# EAGLE design Thermocouple_datalogger_RevB (EAGLE 7.5.0)
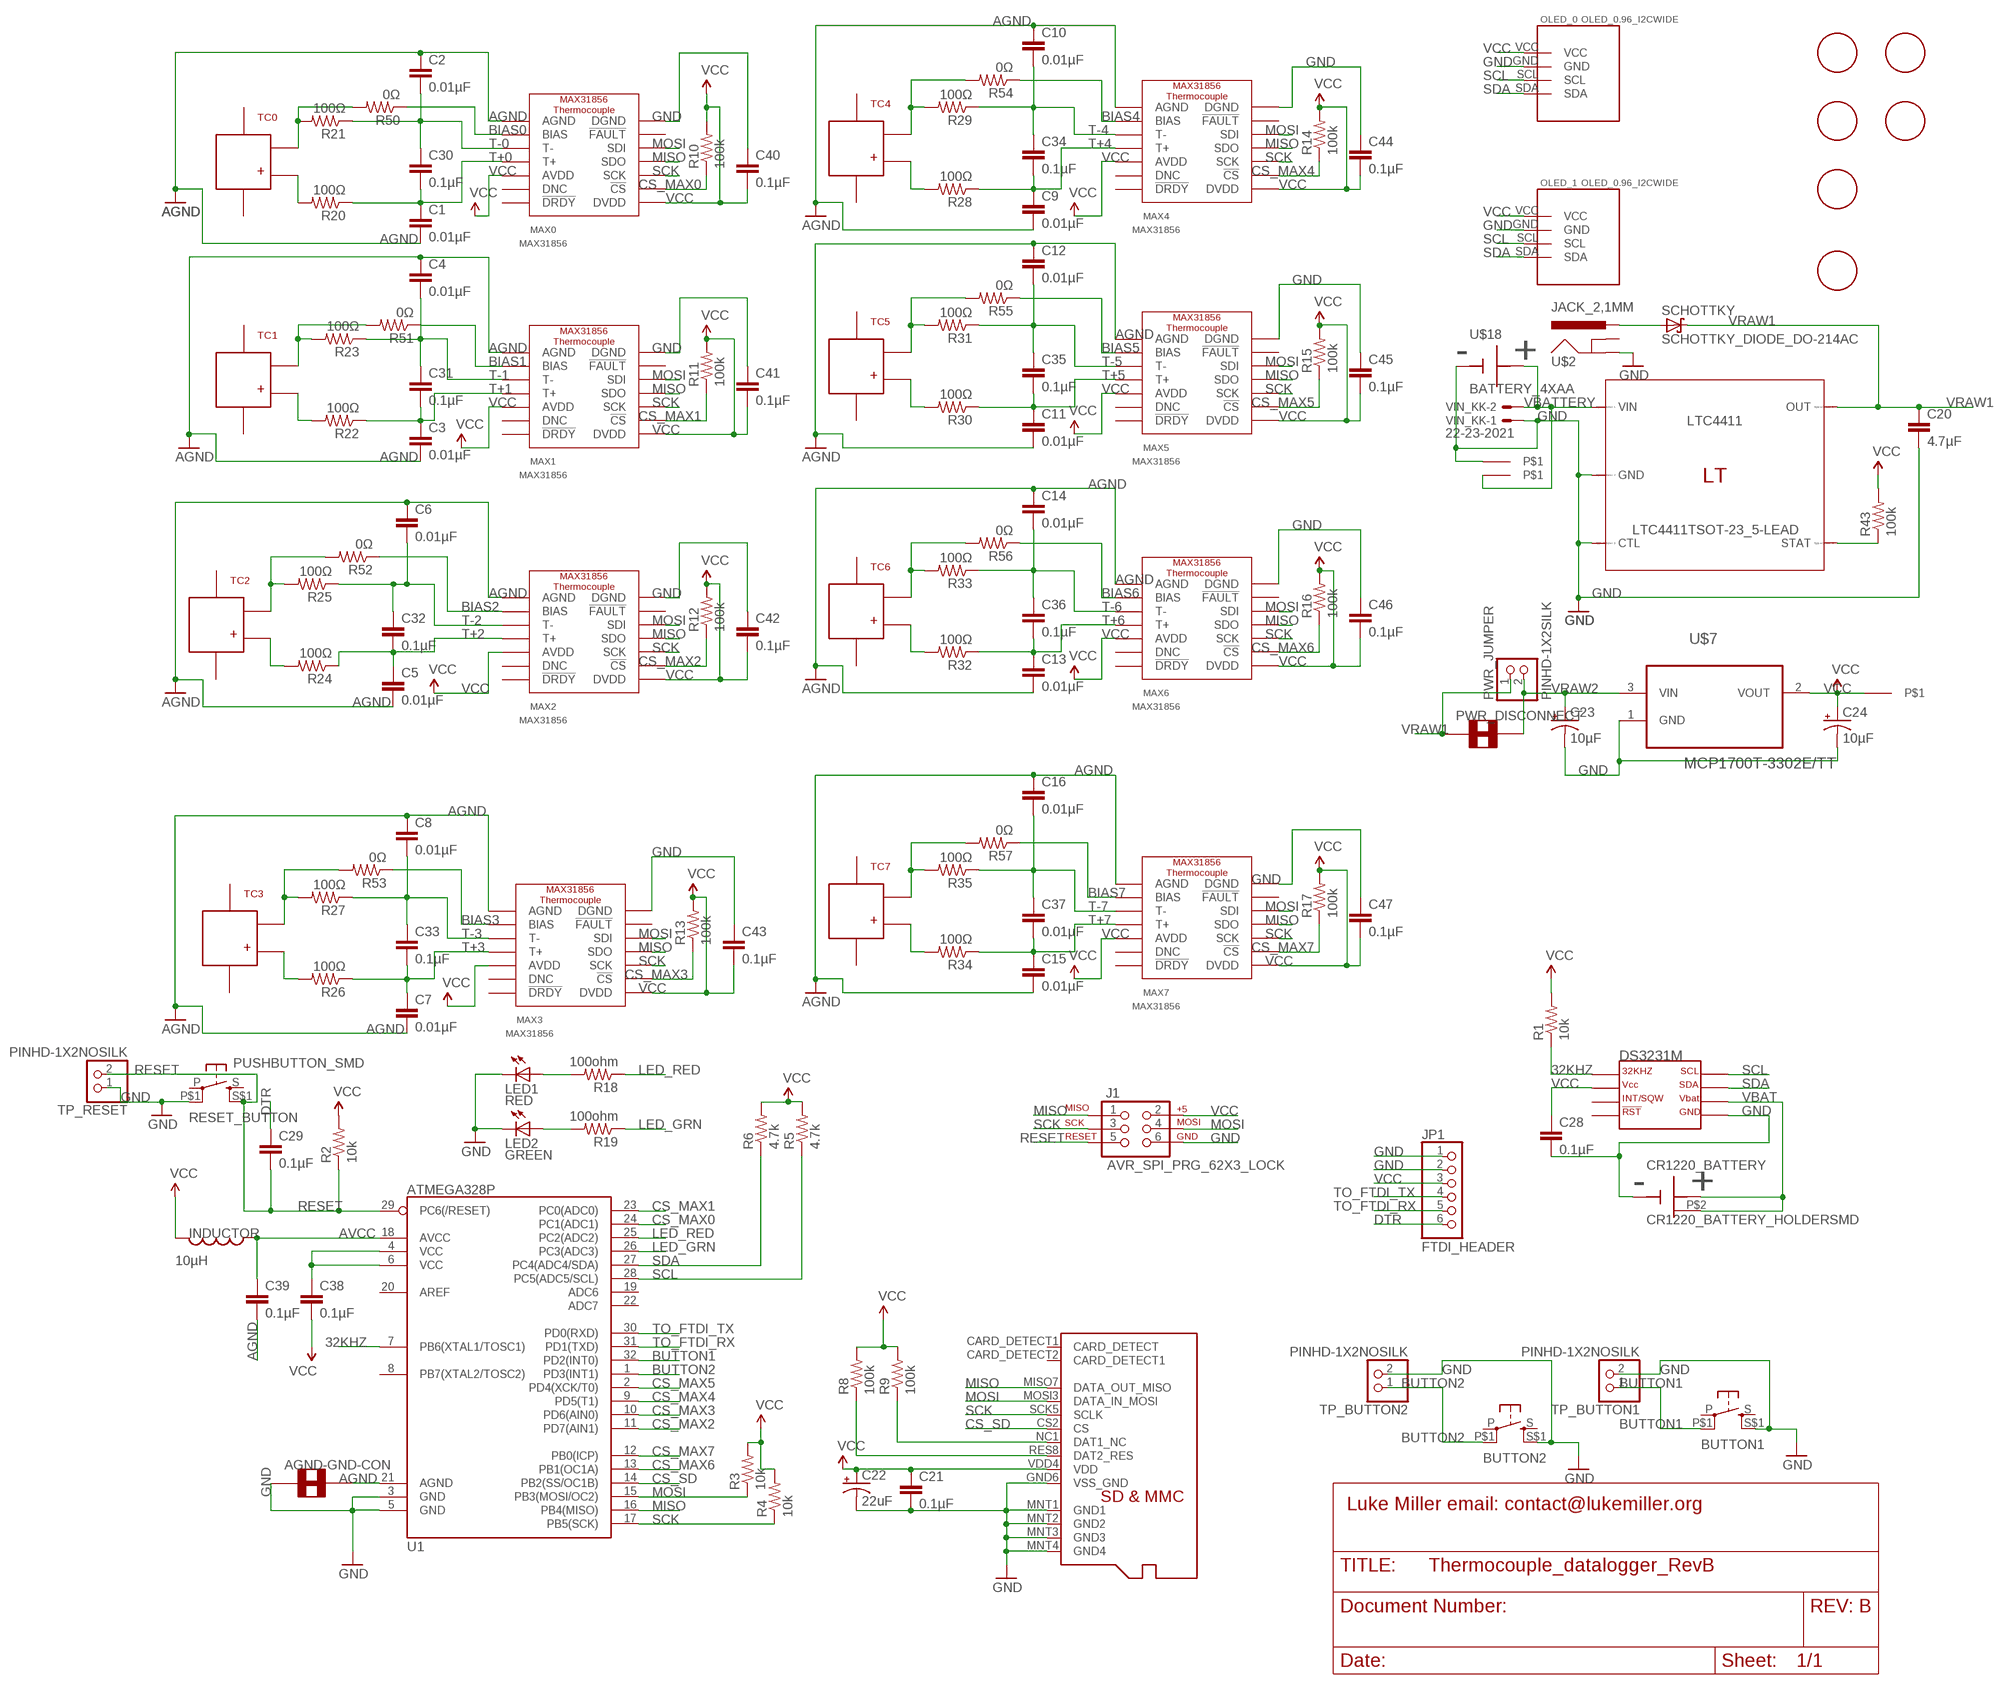
[diagram p0: schematic, sheet 1]

## Parts
AGND-GND-CON  SOLDER_JUMPER_TRACESTANDARD  [SJ_2S-TRACE]
BUTTON1  PUSHBUTTON_DPST_SMDSTANDARD  [PUSHBUTTON_DPST_SMD]
BUTTON2  PUSHBUTTON_DPST_SMDSTANDARD  [PUSHBUTTON_DPST_SMD]
C1  0.01µF  CAP0805  [0805]
C2  0.01µF  CAP0805  [0805]
C3  0.01µF  CAP0805  [0805]
C4  0.01µF  CAP0805  [0805]
C5  0.01µF  CAP0805  [0805]
C6  0.01µF  CAP0805  [0805]
C7  0.01µF  CAP0805  [0805]
C8  0.01µF  CAP0805  [0805]
C9  0.01µF  CAP0805  [0805]
C10  0.01µF  CAP0805  [0805]
C11  0.01µF  CAP0805  [0805]
C12  0.01µF  CAP0805  [0805]
C13  0.01µF  CAP0805  [0805]
C14  0.01µF  CAP0805  [0805]
C15  0.01µF  CAP0805  [0805]
C16  0.01µF  CAP0805  [0805]
C20  4.7µF  CAP0805  [0805]
C21  0.1µF  CAP0805  [0805]
C22  22uF  CPOL-US0805  [C0805_POL]
C23  10µF  CPOL-USB  [PANASONIC_B]
C24  10µF  CPOL-USB  [PANASONIC_B]
C28  0.1µF  CAP0805  [0805]
C29  0.1µF  CAP0805  [0805]
C30  0.1µF  CAP0805  [0805]
C31  0.1µF  CAP0805  [0805]
C32  0.1µF  CAP0805  [0805]
C33  0.1µF  CAP0805  [0805]
C34  0.1µF  CAP0805  [0805]
C35  0.1µF  CAP0805  [0805]
C36  0.1µF  CAP0805  [0805]
C37  0.01µF  CAP0805  [0805]
C38  0.1µF  CAP0805  [0805]
C39  0.1µF  CAP0805  [0805]
C40  0.1µF  CAP0805  [0805]
C41  0.1µF  CAP0805  [0805]
C42  0.1µF  CAP0805  [0805]
C43  0.1µF  CAP0805  [0805]
C44  0.1µF  CAP0805  [0805]
C45  0.1µF  CAP0805  [0805]
C46  0.1µF  CAP0805  [0805]
C47  0.1µF  CAP0805  [0805]
CR1220_BATTERY  CR1220_BATTERY_HOLDERSMD  [CR1220_BATTERY_HOLDER_SMD]
DS3231M  DS3231MSOIC-8  [DS3231M_SOIC8]
INDUCTOR  10µH  INDUCTOR0805_TY  [I_0805]
J1  AVR_SPI_PRG_62X3_LOCK  [2X3_LOCK]
JP1  FTDI_HEADER  PINHD-1X6RA  [1X06-RIGHT_ANGLE]
LED1  RED  LED0805  [CHIPLED_0805]
LED2  GREEN  LED0805  [CHIPLED_0805]
LTC4411  LTC4411TSOT-23_5-LEAD  [TSOT-23_5-LEAD]
MAX0  MAX31856  [MAX31856_TSSOP14]
MAX1  MAX31856  [MAX31856_TSSOP14]
MAX2  MAX31856  [MAX31856_TSSOP14]
MAX3  MAX31856  [MAX31856_TSSOP14]
MAX4  MAX31856  [MAX31856_TSSOP14]
MAX5  MAX31856  [MAX31856_TSSOP14]
MAX6  MAX31856  [MAX31856_TSSOP14]
MAX7  MAX31856  [MAX31856_TSSOP14]
OLED_0  OLED_0.96_I2CWIDE  [OLED_0.96_I2C_VCC_PIN1_WIDE]
OLED_1  OLED_0.96_I2CWIDE  [OLED_0.96_I2C_VCC_PIN1_WIDE]
PWR_DISCONNECT  SOLDER_JUMPER_TRACESTANDARD  [SJ_2S-TRACE]
PWR_JUMPER  PINHD-1X2SILK  [1X02]
R1  10k  RESISTOR_SMDR0805  [R0805]
R2  10k  RESISTOR_SMDR0805  [R0805]
R3  10k  RESISTOR_SMDR0805  [R0805]
R4  10k  RESISTOR_SMDR0805  [R0805]
R5  4.7k  RESISTOR_SMDR0805  [R0805]
R6  4.7k  RESISTOR_SMDR0805  [R0805]
R8  100k  RESISTOR_SMDR0805  [R0805]
R9  100k  RESISTOR_SMDR0805  [R0805]
R10  100k  RESISTOR_SMDR0805  [R0805]
R11  100k  RESISTOR_SMDR0805  [R0805]
R12  100k  RESISTOR_SMDR0805  [R0805]
R13  100k  RESISTOR_SMDR0805  [R0805]
R14  100k  RESISTOR_SMDR0805  [R0805]
R15  100k  RESISTOR_SMDR0805  [R0805]
R16  100k  RESISTOR_SMDR0805  [R0805]
R17  100k  RESISTOR_SMDR0805  [R0805]
R18  100ohm  RESISTOR_SMDR0805  [R0805]
R19  100ohm  RESISTOR_SMDR0805  [R0805]
R20  100Ω  RESISTOR_SMDR0805  [R0805]
R21  100Ω  RESISTOR_SMDR0805  [R0805]
R22  100Ω  RESISTOR_SMDR0805  [R0805]
R23  100Ω  RESISTOR_SMDR0805  [R0805]
R24  100Ω  RESISTOR_SMDR0805  [R0805]
R25  100Ω  RESISTOR_SMDR0805  [R0805]
R26  100Ω  RESISTOR_SMDR0805  [R0805]
R27  100Ω  RESISTOR_SMDR0805  [R0805]
R28  100Ω  RESISTOR_SMDR0805  [R0805]
R29  100Ω  RESISTOR_SMDR0805  [R0805]
R30  100Ω  RESISTOR_SMDR0805  [R0805]
R31  100Ω  RESISTOR_SMDR0805  [R0805]
R32  100Ω  RESISTOR_SMDR0805  [R0805]
R33  100Ω  RESISTOR_SMDR0805  [R0805]
R34  100Ω  RESISTOR_SMDR0805  [R0805]
R35  100Ω  RESISTOR_SMDR0805  [R0805]
R43  100k  RESISTOR_SMDR0805  [R0805]
R50  0Ω  RESISTOR_SMDR0805  [R0805]
R51  0Ω  RESISTOR_SMDR0805  [R0805]
R52  0Ω  RESISTOR_SMDR0805  [R0805]
R53  0Ω  RESISTOR_SMDR0805  [R0805]
R54  0Ω  RESISTOR_SMDR0805  [R0805]
R55  0Ω  RESISTOR_SMDR0805  [R0805]
R56  0Ω  RESISTOR_SMDR0805  [R0805]
R57  0Ω  RESISTOR_SMDR0805  [R0805]
RESET_BUTTON  PUSHBUTTON_SMD  PUSHBUTTON_DPST_SMDSTANDARD  [PUSHBUTTON_DPST_SMD]
SCHOTTKY  SCHOTTKY_DIODE_DO-214AC  [DO214AC]
TC0  PCC-SMP-THERMOCOUPLEVERTICAL  [PCC-SMP-V]
TC1  PCC-SMP-THERMOCOUPLEVERTICAL  [PCC-SMP-V]
TC2  PCC-SMP-THERMOCOUPLEVERTICAL  [PCC-SMP-V]
TC3  PCC-SMP-THERMOCOUPLEVERTICAL  [PCC-SMP-V]
TC4  PCC-SMP-THERMOCOUPLEVERTICAL  [PCC-SMP-V]
TC5  PCC-SMP-THERMOCOUPLEVERTICAL  [PCC-SMP-V]
TC6  PCC-SMP-THERMOCOUPLEVERTICAL  [PCC-SMP-V]
TC7  PCC-SMP-THERMOCOUPLEVERTICAL  [PCC-SMP-V]
TP_BUTTON1  PINHD-1X2NOSILK  [1X02_NOSILK]
TP_BUTTON2  PINHD-1X2NOSILK  [1X02_NOSILK]
TP_GND  PINHD-1X1STANDARD  [1X01]
TP_RESET  PINHD-1X2NOSILK  [1X02_NOSILK]
TP_VBAT  PINHD-1X1STANDARD  [1X01]
U1  ATMEGA328P  ATMEGA328_SMT  [TQFP32-08]
U$2  JACK_2,1MM  POWER_JACK_2,1MM  [POWER_JACK_DC_2,1MM]
U$5  MICROSD_MOLEX_REVERSECURRENT  [MICROSD_SOCKET_MOLEX_REVERSEMOUNT]
U$6  HOLE-LAYOUT4-40-SOCKET-HEAD  [4-40-SCREW-HOLE]
U$7  MCP1700T-3302E/TT  [SOT95P237X112-3N]
U$15  HOLE-LAYOUT4-40-SOCKET-HEAD  [4-40-SCREW-HOLE]
U$16  HOLE-LAYOUT4-40-SOCKET-HEAD  [4-40-SCREW-HOLE]
U$18  BATTERY_4XAA  [BATTERY_4XAA_PTH]
U$23  HOLE-LAYOUT4-40-SOCKET-HEAD  [4-40-SCREW-HOLE]
U$24  HOLE-LAYOUT4-40-SOCKET-HEAD  [4-40-SCREW-HOLE]
U$25  HOLE-LAYOUT4-40-SOCKET-HEAD  [4-40-SCREW-HOLE]
VCC  PINHD-1X1STANDARD  [1X01]
VIN_KK  22-23-2021  [22-23-2021]

## Nets
32KHZ: DS3231M.1(P$1_32KHZ) R1.1 U1.7(PB6(XTAL1/TOSC1))
AGND: AGND-GND-CON.2 C1.2 C2.1 C3.2 C4.1 C5.2 C6.1 C7.2 C8.1 C9.2 C10.1 C11.2 C12.1 C13.2 C14.1 C15.2 C16.1 C39.2 MAX0.AGND MAX1.AGND MAX2.AGND MAX3.AGND MAX4.AGND MAX5.AGND MAX6.AGND MAX7.AGND U1.21(AGND)
AVCC: C39.1 INDUCTOR.P$1 U1.18(AVCC)
BIAS0: MAX0.BIAS R50.1
BIAS1: MAX1.BIAS R51.1
BIAS2: MAX2.BIAS R52.1
BIAS3: MAX3.BIAS R53.1
BIAS4: MAX4.BIAS R54.1
BIAS5: MAX5.BIAS R55.1
BIAS6: MAX6.BIAS R56.1
BIAS7: MAX7.BIAS R57.1
BUTTON1: BUTTON1.P$1(P1) TP_BUTTON1.1 U1.32(PD2(INT0))
BUTTON2: BUTTON2.P$1(P1) TP_BUTTON2.1 U1.1(PD3(INT1))
CS_MAX0: MAX0.!CS R10.1 U1.24(PC1(ADC1))
CS_MAX1: MAX1.!CS R11.1 U1.23(PC0(ADC0))
CS_MAX2: MAX2.!CS R12.1 U1.11(PD7(AIN1))
CS_MAX3: MAX3.!CS R13.1 U1.10(PD6(AIN0))
CS_MAX4: MAX4.!CS R14.1 U1.9(PD5(T1))
CS_MAX5: MAX5.!CS R15.1 U1.2(PD4(XCK/T0))
CS_MAX6: MAX6.!CS R16.1 U1.13(PB1(OC1A))
CS_MAX7: MAX7.!CS R17.1 U1.12(PB0(ICP))
CS_SD: U1.14(PB2(SS/OC1B)) U$5.CS2(CS)
DTR: C29.1 JP1.6
GND: AGND-GND-CON.1 BUTTON1.S$1(S1) BUTTON2.S$1(S1) C20.2 C21.2 C22.P$2_C(-) C23.- C24.- C28.2 C40.1 C41.1 C42.1 C43.1 C44.1 C45.1 C46.1 C47.1 CR1220_BATTERY.GND DS3231M.5(P$5_GND) J1.6 JP1.1 JP1.2 LED1.C LED2.C LTC4411.2(GND) LTC4411.3(CTL) MAX0.DGND MAX1.DGND MAX2.DGND MAX3.DGND MAX4.DGND MAX5.DGND MAX6.DGND MAX7.DGND OLED_0.GND OLED_1.GND RESET_BUTTON.P$1(P1) TP_BUTTON1.2 TP_BUTTON2.2 TP_GND.1 TP_RESET.1 U1.3(GND) U1.5(GND) U$2.P$2(GND) U$5.GND6(VSS_GND) U$5.MNT1(GND1) U$5.MNT2(GND2) U$5.MNT3(GND3) U$5.MNT4(GND4) U$7.1(GND) U$18.GND VIN_KK.1
LED_GRN: R19.1 U1.26(PC3(ADC3))
LED_RED: R18.1 U1.25(PC2(ADC2))
MISO: J1.1 MAX0.SDO MAX1.SDO MAX2.SDO MAX3.SDO MAX4.SDO MAX5.SDO MAX6.SDO MAX7.SDO U1.16(PB4(MISO)) U$5.MISO7(DATA_OUT_MISO)
MOSI: J1.4 MAX0.SDI MAX1.SDI MAX2.SDI MAX3.SDI MAX4.SDI MAX5.SDI MAX6.SDI MAX7.SDI R3.1 U1.15(PB3(MOSI/OC2)) U$5.MOSI3(DATA_IN_MOSI)
N$1: LTC4411.4(STAT) R43.1
N$2: SCHOTTKY.A U$2.P$1(PWR)
N$5: LED1.A R18.2
N$7: R8.1 U$5.RES8(DAT2_RES)
N$8: R9.1 U$5.NC1(DAT1_NC)
N$9: C38.1 U1.4(VCC) U1.6(VCC)
N$10: LED2.A R19.2
N$13: R22.2 TC1.P$2
N$14: R23.2 R51.2 TC1.P$1
N$17: R24.2 TC2.P$2
N$18: R25.2 R52.2 TC2.P$1
N$21: R26.2 TC3.P$2
N$22: R27.2 R53.2 TC3.P$1
N$25: R28.2 TC4.P$2
N$26: R29.2 R54.2 TC4.P$1
N$29: R30.2 TC5.P$2
N$30: R31.2 R55.2 TC5.P$1
N$33: R32.2 TC6.P$2
N$34: R33.2 R56.2 TC6.P$1
N$37: R34.2 TC7.P$2
N$38: R35.2 R57.2 TC7.P$1
RESET: C29.2 J1.5 R2.1 RESET_BUTTON.S$1(S1) TP_RESET.2 U1.29(PC6(/RESET))
SCK: J1.3 MAX0.SCK MAX1.SCK MAX2.SCK MAX3.SCK MAX4.SCK MAX5.SCK MAX6.SCK MAX7.SCK R4.1 U1.17(PB5(SCK)) U$5.SCK5(SCLK)
SCL: DS3231M.8(P$8_SCL) OLED_0.SCL OLED_1.SCL R5.1 U1.28(PC5(ADC5/SCL))
SDA: DS3231M.7(P$7_SDA) OLED_0.SDA OLED_1.SDA R6.1 U1.27(PC4(ADC4/SDA))
T+0: C1.1 C30.2 MAX0.T+ R20.1
T+0_TERM: R20.2 TC0.P$2
T+1: C3.1 C31.2 MAX1.T+ R22.1
T+2: C5.1 C32.2 MAX2.T+ R24.1
T+3: C7.1 C33.2 MAX3.T+ R26.1
T+4: C9.1 C34.2 MAX4.T+ R28.1
T+5: C11.1 C35.2 MAX5.T+ R30.1
T+6: C13.1 C36.2 MAX6.T+ R32.1
T+7: C15.1 C37.2 MAX7.T+ R34.1
T-0: C2.2 C30.1 MAX0.T- R21.1
T-0_TERM: R21.2 R50.2 TC0.P$1
T-1: C4.2 C31.1 MAX1.T- R23.1
T-2: C6.2 C32.1 MAX2.T- R25.1
T-3: C8.2 C33.1 MAX3.T- R27.1
T-4: C10.2 C34.1 MAX4.T- R29.1
T-5: C12.2 C35.1 MAX5.T- R31.1
T-6: C14.2 C36.1 MAX6.T- R33.1
T-7: C16.2 C37.1 MAX7.T- R35.1
TO_FTDI_RX: JP1.5 U1.31(PD1(TXD))
TO_FTDI_TX: JP1.4 U1.30(PD0(RXD))
VBAT: CR1220_BATTERY.P$1(VBAT) CR1220_BATTERY.P$2 DS3231M.6(P$6_VBAT)
VBATTERY: LTC4411.1(VIN) TP_VBAT.1 U$18.VBAT VIN_KK.2
VCC: C21.1 C22.P$1_A(+) C24.+ C28.1 C38.2 C40.2 C41.2 C42.2 C43.2 C44.2 C45.2 C46.2 C47.2 DS3231M.2(P$2_VCC) INDUCTOR.P$2 J1.2 JP1.3 MAX0.AVDD MAX0.DVDD MAX1.AVDD MAX1.DVDD MAX2.AVDD MAX2.DVDD MAX3.AVDD MAX3.DVDD MAX4.AVDD MAX4.DVDD MAX5.AVDD MAX5.DVDD MAX6.AVDD MAX6.DVDD MAX7.AVDD MAX7.DVDD OLED_0.VCC OLED_1.VCC R1.2 R2.2 R3.2 R4.2 R5.2 R6.2 R8.2 R9.2 R10.2 R11.2 R12.2 R13.2 R14.2 R15.2 R16.2 R17.2 R43.2 U$5.VDD4(VDD) U$7.2(VOUT) VCC.1
VRAW1: C20.1 LTC4411.5(OUT) PWR_DISCONNECT.1 PWR_JUMPER.1 SCHOTTKY.C
VRAW2: C23.+ PWR_DISCONNECT.2 PWR_JUMPER.2 U$7.3(VIN)
Unconnected: BUTTON1.P BUTTON1.S BUTTON2.P BUTTON2.S DS3231M.3(P$3_INT) DS3231M.4(P$4_RST) MAX0.6(DNC) MAX0.!DRDY MAX0.!FAULT MAX1.6(DNC) MAX1.!DRDY MAX1.!FAULT MAX2.6(DNC) MAX2.!DRDY MAX2.!FAULT MAX3.6(DNC) MAX3.!DRDY MAX3.!FAULT MAX4.6(DNC) MAX4.!DRDY MAX4.!FAULT MAX5.6(DNC) MAX5.!DRDY MAX5.!FAULT MAX6.6(DNC) MAX6.!DRDY MAX6.!FAULT MAX7.6(DNC) MAX7.!DRDY MAX7.!FAULT RESET_BUTTON.P RESET_BUTTON.S TC0.P$3 TC0.P$4 TC1.P$3 TC1.P$4 TC2.P$3 TC2.P$4 TC3.P$3 TC3.P$4 TC4.P$3 TC4.P$4 TC5.P$3 TC5.P$4 TC6.P$3 TC6.P$4 TC7.P$3 TC7.P$4 U1.8(PB7(XTAL2/TOSC2)) U1.19(ADC6) U1.20(AREF) U1.22(ADC7) U$2.P$3(GNDBREAK) U$5.CARD_DETECT1(CARD_DETECT) U$5.CARD_DETECT2(CARD_DETECT1)

## Library data of the parts
AGND-GND-CON PWR_DISCONNECT = miller:SOLDER_JUMPER_TRACE: Solder jumper with trace Treat this like a zero ohm resistor. The trace can be cut with a knife.
BUTTON1 BUTTON2 RESET_BUTTON = miller:PUSHBUTTON_DPST_SMD: PUSHBUTTON DPST SMD Omron B3S-1000 Digikey PN SW836CT-ND This is your standard "hobbyist" style momentary pushbutton in a surface mount package.
C1-C16 C20 C21 C28-C47 = miller:CAP: Capacitor Standard surface mount ceramic capacitor and 0.1" leaded capacitor.
C22-C24 = miller:CPOL-US: POLARIZED CAPACITOR, American symbol
CR1220_BATTERY = miller:CR1220_BATTERY_HOLDER: CR1220 Battery Holder Keystone Part # 3001 Digikey 3001K-ND
DS3231M = miller:DS3231M: DS3231M real time clock Battery backup, 2.3V to 5.5V supply voltage 1Hz and 32.768kHz outputs NOTE: This is a slightly lower cost version of the regular DS3231S, with fewer clock frequency output options and slightly lower long-term time accuracy. It uses the same I2C communications protocol as the DS3231S, and is available in a small SOIC-8 package or Wide SOIC-16 (0.300") package. Maxim PN DS3231MZ+ SOIC-8 package Maxim PN DS3231M+ SOIC-16 Wide package
INDUCTOR = miller:INDUCTOR: Inductor Example: Taiyo Yuden PN LBR2012T100K
J1 = miller:AVR_SPI_PRG_6: AVR ISP 6 Pin This is the reduced ISP connector for AVR programming. Common on Arduino. This footprint will take up less PCB space and can be used with a 10-pin to 6-pin adapter such as SKU: BOB-08508 **Special note about "TEST_POINT" package. The stop mask is on the top side, so if you want your programming test points to be on the bottom of your board, make sure to place this package on the bottom side of the board. This also ensure that the orientation to program from the bottom side will be correct.
JP1 = miller:PINHD-1X6: PIN HEADER
LED1 LED2 = miller:LED: LEDs Standard schematic elements and footprints for 5mm, 3mm, 1206, and 0603 sized LEDs. 5mm - Spark Fun Electronics SKU : COM-00529 (and others)
LTC4411 = miller:LTC4411: 2.6A Low Loss Ideal diode in ThinSOT; SPICEMODEL: LTC4411.sub; VALUE2: LTC4411
MAX0 MAX1-MAX7 = miller:MAX31856: MAX31856 Thermocouple convertor Maxim Integrated Digikey PN MAX31856MUD+-ND <https://www.digikey.com/product-detail/en/maxim-integrated/MAX31856MUD-/MAX31856MUD--ND/5050138>
OLED_0 OLED_1 = miller:OLED_0.96_I2C: CHECK VCC & GND PIN VARIANT OLED 128x64 0.96" I2C module Generic 4-pin I2C OLED module from ebay/amazon etc. SSD1306 driver
PWR_JUMPER TP_BUTTON1 TP_BUTTON2 TP_RESET = miller:PINHD-1X2: 1x2 pin header 0.1" spacing (2.54mm)
R1-R6 R8-R35 R43 R50-R57 = miller:RESISTOR_SMD: RESISTOR, American symbol
SCHOTTKY = miller:SCHOTTKY_DIODE: Schottky diode Example Vishay SS12-E3/61T, Digikey PN SS12-E3/61TGICT-ND
TC0 TC1-TC7 = miller:PCC-SMP-THERMOCOUPLE: PCC-SMP Miniature thermocouple mount connector. Omega Engineering PCC-SMP or PCC-SMP-V (vertical mount)
TP_GND TP_VBAT VCC = miller:PINHD-1X1: Just a single pin header, useful for making test point or stand-alone header hole for normal 0.1" pitch through-hole header pins The SMALL footprint is 0.035" diameter, barely large enough for standard 0.1" pitch header pins. The SMALL_0.7 footprint is 1.056mm diameter, drill hole is 0.7mm, too small for 0.1" pitch header pins
U1 = miller:ATMEGA328_SMT: 32-Pin Atmega328
U$2 = miller:POWER_JACK_2,1MM: DC Power Jack, 2.1mm center pin. Digikey PN CP-202AH-ND
U$5 = miller:MICROSD_MOLEX_REVERSE: Molex micro SD connector, push-push spring loaded, "reverse" mount Pins accessible at rear of case. Active: Molex PN 5027740891 Digikey PN WM24066CT-ND Obsolete: Molex PN 49225-201
U$6 U$15 U$16 U$23-U$25 = miller:HOLE-LAYOUT: Drill hole
U$7 = Microchip_By_element14_Batch_1:MCP1700T-3302E/TT: Low Quiescent Current LDO; MPN: MCP1700T-3302E/TT; OC_FARNELL: 1296592; OC_NEWARK: 88H9817; PACKAGE: SOT23-3; SUPPLIER: Microchip
U$18 = miller:BATTERY_4XAA: Battery holder 4xAA Plastic, through-hole mount, 4xAA. Keystone PN 2477
VIN_KK = miller:22-23-2021: Molex KK series .100" (2.54mm) Center Header - 2 Pin; MF: MOLEX; MPN: 22-23-2021; OC_FARNELL: 1462926; OC_NEWARK: 25C3832

## Board
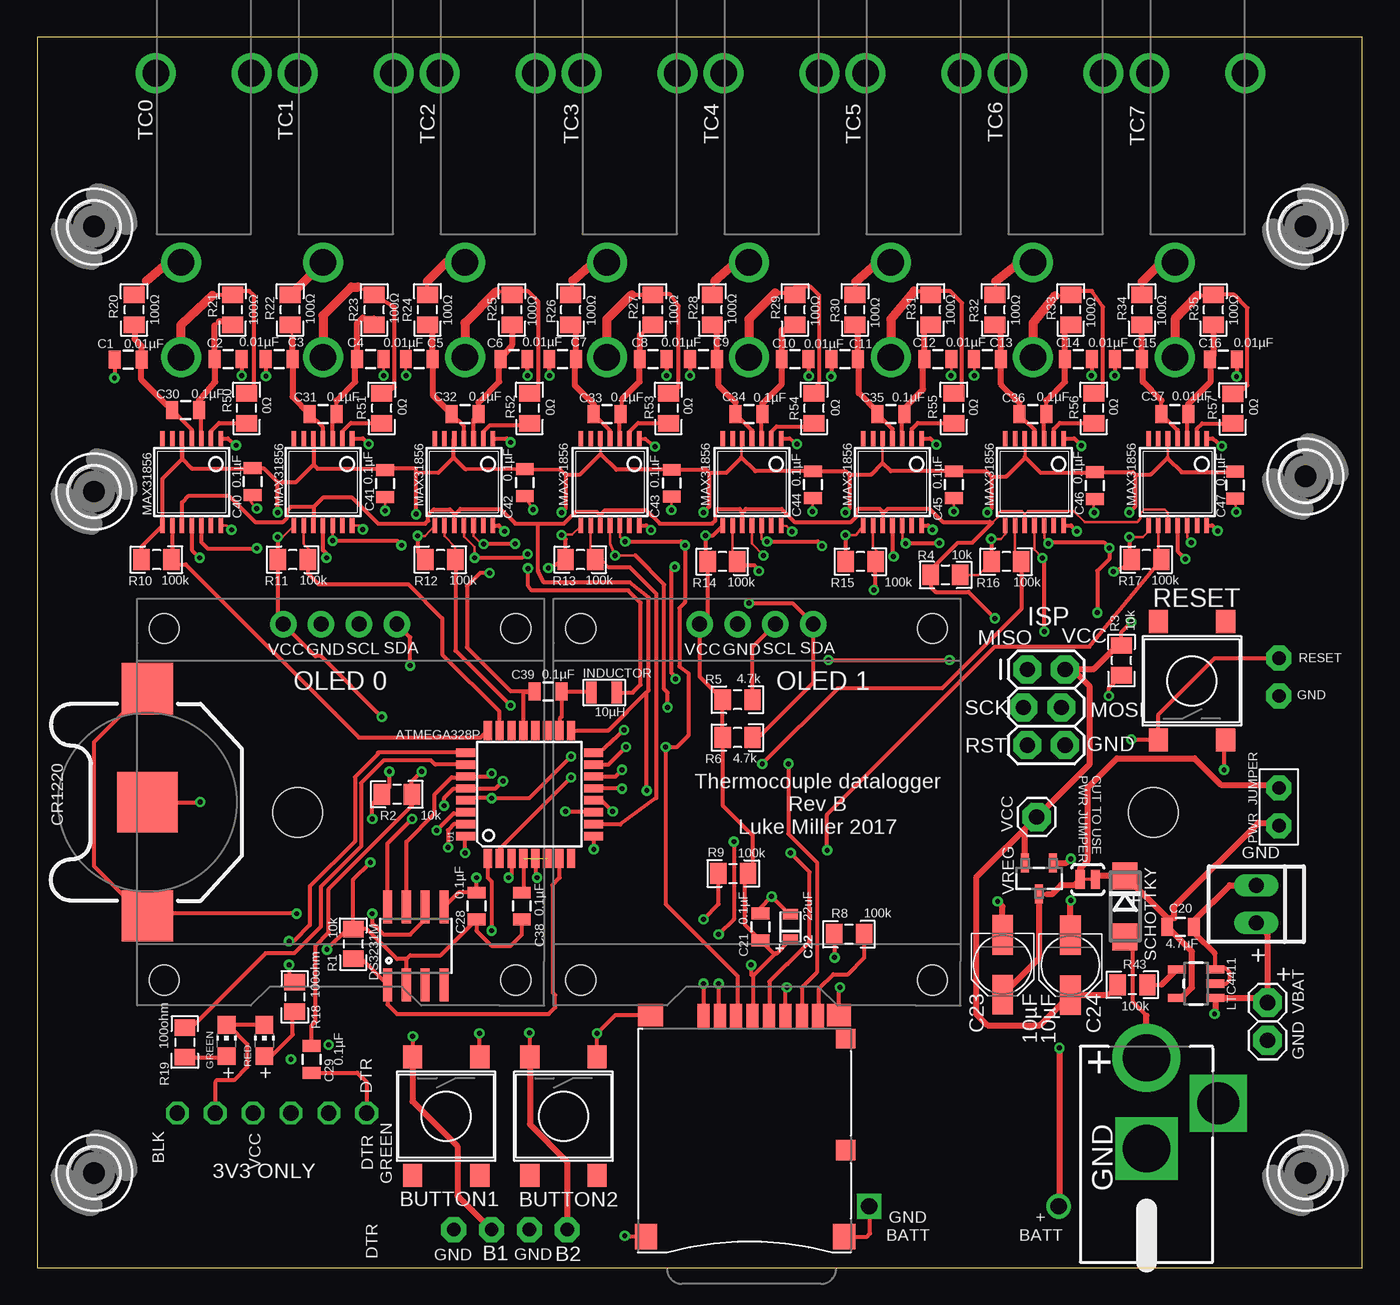
[diagram p1: board, top side]
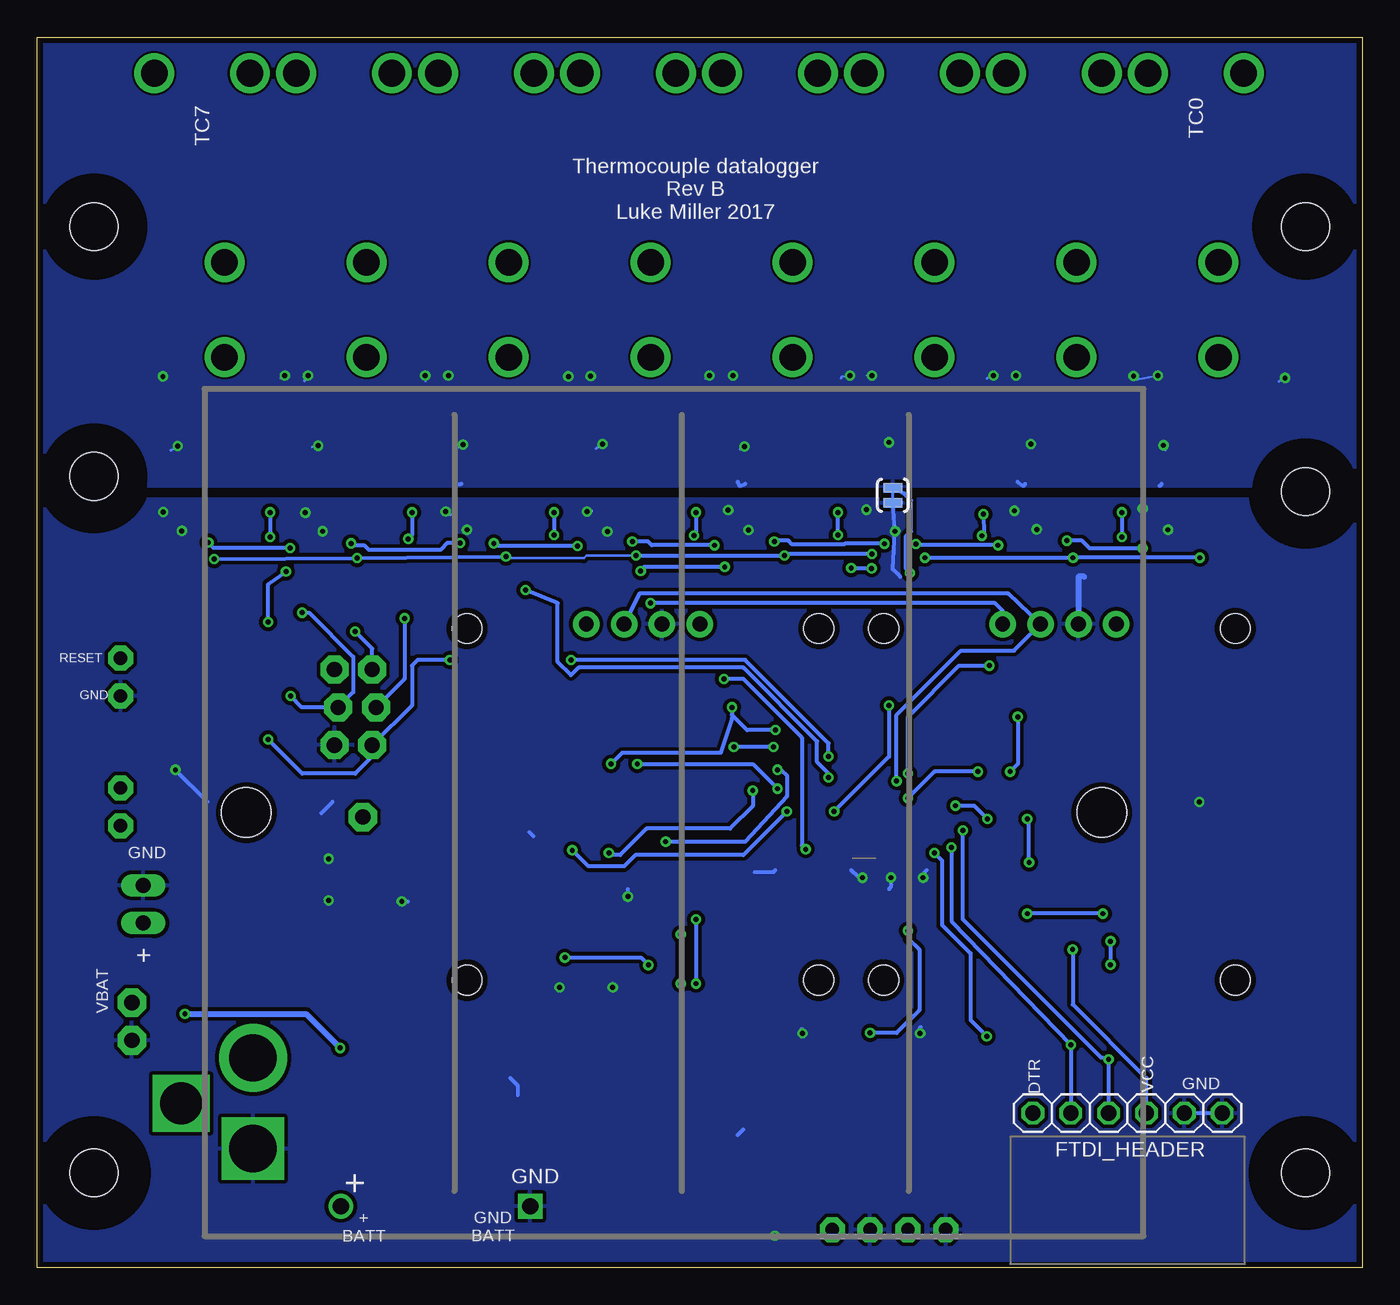
[diagram p2: board, bottom side, seen from below]

Size 88.9 x 82.55 mm. Coordinates in mm from the lower left corner, seen from the top.
Outline: 0,0 88.9,0 88.9,82.55 0,82.55 0,0
Copper layers (1*16): Top 0.0356mm / dielectric 1.5011mm / Bottom 0.0356mm
Design rules "LaenPCBOrder *": minimum track width 6mil, minimum drill 13mil, track to track 6mil, track to pad 6mil, pad to pad 6mil, via to via 6mil, smd to smd 6mil, copper to edge 15mil, drill to drill 6mil, minimum pad ring 7mil, minimum via ring 7mil, stop-mask expansion 3mil, vias tented up to drill 30mil, thermal gap 10mil

### Footprints (pad centres in the part's own frame; a part is rotated, then mirrored left to right if it is on the bottom)
SJ_2S-TRACE = smd 0.635 x 1.27: 1 -0.508,0; 2 0.508,0
PUSHBUTTON_DPST_SMD = smd 1.55 x 1.3: P 3.975,-2.25; P$1 -3.975,-2.25; S 3.975,2.25; S$1 -3.975,2.25
0805 = smd 0.8 x 1.2: 1 -0.9,0; 2 0.9,0
C0805_POL = smd 0.7 x 1: P$1_A -0.85,0; P$2_C 0.85,0
PANASONIC_B = smd 2.667 x 1.4: + 2.006,0; - -2.006,0
CR1220_BATTERY_HOLDER_SMD = smd 4.064 x 4.064: GND 0,0 | smd 3.429 x 3.429: P$1 -7.62,0; P$2 7.62,0
DS3231M_SOIC8 = smd 0.61 x 2.21: 1 -1.905,-2.616; 2 -0.635,-2.616; 3 0.635,-2.616; 4 1.905,-2.616; 5 1.905,2.616; 6 0.635,2.616; 7 -0.635,2.616; 8 -1.905,2.616
I_0805 = smd 0.7 x 1.45: P$1 -0.85,0; P$2 0.85,0
2X3_LOCK = drill 1.016 pad 1.88 octagon: 1 0,0; 2 0,2.54; 3 2.54,-0.254; 4 2.54,2.286; 5 5.08,0; 6 5.08,2.54
1X06-RIGHT_ANGLE = drill 1.016 octagon: 1 0,0; 2 2.54,0; 3 5.08,0; 4 7.62,0; 5 10.16,0; 6 12.7,0
CHIPLED_0805 = smd 1.2 x 1.2: A 0,-1.05; C 0,1.05
TSOT-23_5-LEAD = smd 0.55 x 1.2: 1 -0.95,-1.3; 2 0,-1.3; 3 0.95,-1.3; 4 0.95,1.3; 5 -0.95,1.3
MAX31856_TSSOP14 = smd 0.991 x 0.305: 6 -2.918,-1.3; !CS 2.918,-1.3; !DRDY -2.918,-1.95; !FAULT 2.918,1.3; AGND -2.918,1.95; AVDD -2.918,-0.65; BIAS -2.918,1.3; DGND 2.918,1.95; DVDD 2.918,-1.95; SCK 2.918,-0.65; SDI 2.918,0.65; SDO 2.918,0; T+ -2.918,0; T- -2.918,0.65
OLED_0.96_I2C_VCC_PIN1_WIDE = drill 1 pad 1.778: GND -1.274,-0.003; SCL 1.266,-0.003; SDA 3.806,-0.003; VCC -3.814,-0.003 | hole 2: -11.798,-23.899; 11.798,-23.899; 11.798,-0.303; -11.798,-0.303
1X02 = drill 0.9 pad 1.676 octagon: 1 -1.27,0; 2 1.27,0
R0805 = smd 1.1 x 1.4: 1 -1,0; 2 1,0
DO214AC = smd 1.8 x 1.7: A 2.05,0; C -2.05,0
PCC-SMP-V = drill 1.778: P$1 0,0; P$2 -6.35,0; P$3 -19.05,-1.702; P$4 -19.05,4.724
1X02_NOSILK = drill 0.9 pad 1.676 octagon: 1 -1.27,0; 2 1.27,0
1X01 = drill 1.016 pad 1.93 octagon: 1 0,0
TQFP32-08 = smd 1.27 x 0.559: 1 -4.293,2.8; 2 -4.293,2; 3 -4.293,1.2; 4 -4.293,0.4; 5 -4.293,-0.4; 6 -4.293,-1.2; 7 -4.293,-2; 8 -4.293,-2.8; 17 4.293,-2.8; 18 4.293,-2; 19 4.293,-1.2; 20 4.293,-0.4; 21 4.293,0.4; 22 4.293,1.2; 23 4.293,2; 24 4.293,2.8 | smd 0.559 x 1.27: 9 -2.8,-4.293; 10 -2,-4.293; 11 -1.2,-4.293; 12 -0.4,-4.293; 13 0.4,-4.293; 14 1.2,-4.293; 15 2,-4.293; 16 2.8,-4.293; 25 2.8,4.293; 26 2,4.293; 27 1.2,4.293; 28 0.4,4.293; 29 -0.4,4.293; 30 -1.2,4.293; 31 -2,4.293; 32 -2.8,4.293
POWER_JACK_DC_2,1MM = drill 3.175 pad 4.572: P$1 0,0 | drill 3.175 square: P$2 6.096,0 | drill 2.8 square: P$3 3.048,4.826
MICROSD_SOCKET_MOLEX_REVERSEMOUNT = smd 1.29 x 1.4: CARD_DETECT1 -0.645,8.12 | smd 1.29 x 1.3: CARD_DETECT2 -0.645,0.65 | smd 0.8 x 1.68: CS2 7.8,-0.84; GND6 3.4,-0.84; MISO7 2.3,-0.84; MOSI3 6.7,-0.84; NC1 8.9,-0.84; RES8 1.2,-0.84; SCK5 4.5,-0.84; VDD4 5.6,-0.84 | smd 1.6 x 1.5: MNT1 -0.2,-0.93 | smd 1.7 x 1.5: MNT2 12.45,-0.93 | smd 1.5 x 1.7: MNT3 -0.54,13.92; MNT4 12.75,13.92
4-40-SCREW-HOLE = hole 3.2: 0,0
SOT95P237X112-3N = smd 0.559 x 1.27: 1 -0.94,-1.041; 2 0.94,-1.041; 3 0,1.041
BATTERY_4XAA_PTH = drill 1.1 square: GND 26.416,19.05 | drill 1.1: VBAT 26.416,6.35 | hole 3.302: 0,0; 0,57.404
22-23-2021 = drill 1 long: 1 -1.27,0; 2 1.27,0

### Placement (x,y rotation side)
AGND-GND-CON  31.5,51.82 90 bottom
BUTTON1  27.43,10.16 270 top
BUTTON2  35.31,10.16 270 top
C1  6.1,60.91 180 top
C2  12.8,60.96 180 top
C3  16.23,60.96 180 top
C4  22.35,60.96 180 top
C5  25.63,60.96 180 top
C6  31.98,60.96 180 top
C7  35.26,60.96 180 top
C8  41.33,60.96 180 top
C9  44.7,60.96 180 top
C10  50.85,60.96 180 top
C11  54.18,60.96 180 top
C12  60.43,60.96 180 top
C13  63.75,60.96 180 top
C14  69.85,60.96 180 top
C15  73.2,60.96 180 top
C16  79.58,60.93 180 top
C20  76.71,22.86 0 top
C21  48.51,22.86 90 top
C22  50.55,22.86 90 top
C23  64.77,20.32 270 top
C24  69.32,20.29 270 top
C28  29.46,24.26 90 top
C29  18.41,13.97 90 top
C30  9.96,57.53 180 top
C31  19.18,57.28 180 top
C32  28.7,57.28 180 top
C33  38.23,57.28 180 top
C34  47.75,57.28 180 top
C35  57.28,57.28 180 top
C36  66.8,57.28 180 top
C37  76.33,57.28 180 top
C38  32.51,24.26 270 top
C39  34.26,38.66 180 top
C40  14.45,52.73 90 top
C41  23.34,52.6 90 top
C42  32.72,52.68 90 top
C43  42.57,52.63 90 top
C44  52.04,52.53 90 top
C45  61.49,52.53 90 top
C46  70.97,52.48 90 top
C47  80.37,52.5 90 top
CR1220_BATTERY  7.39,31.22 90 top
DS3231M  25.4,21.59 0 top
INDUCTOR  38.02,38.58 0 top
J1  66.42,40.13 270 top
JP1  9.4,10.36 180 bottom
LED1  15.24,15.24 0 top
LED2  12.7,15.24 0 top
LTC4411  77.75,19.05 90 top
MAX0  10.36,52.7 270 top
MAX1  19.18,52.7 270 top
MAX2  28.63,52.7 270 top
MAX3  38.43,52.7 270 top
MAX4  47.96,52.7 270 top
MAX5  57.38,52.7 270 top
MAX6  66.9,52.7 270 top
MAX7  76.5,52.7 270 top
OLED_0  20.32,43.18 0 top
OLED_1  48.26,43.18 0 top
PWR_DISCONNECT  70.48,26.04 180 top
PWR_JUMPER  83.31,30.91 90 top
R1  21.21,21.72 90 top
R2  24.13,31.75 180 top
R3  72.75,40.74 90 top
R4  60.93,46.48 0 top
R5  46.99,38.1 180 top
R6  46.99,35.56 180 top
R8  54.47,22.37 180 top
R9  46.69,26.44 0 top
R10  8,47.5 180 top
R11  17.14,47.5 180 top
R12  27.05,47.5 180 top
R13  36.45,47.5 180 top
R14  45.97,47.37 180 top
R15  55.24,47.37 180 top
R16  65.02,47.37 180 top
R17  74.42,47.5 180 top
R18  17.27,18.16 270 top
R19  9.91,15.11 270 top
R20  6.5,64.26 90 top
R21  13.11,64.26 90 top
R22  16.97,64.26 90 top
R23  22.61,64.26 90 top
R24  26.19,64.26 90 top
R25  31.85,64.26 90 top
R26  35.79,64.26 90 top
R27  41.3,64.26 90 top
R28  45.29,64.26 90 top
R29  50.85,64.26 90 top
R30  54.86,64.26 90 top
R31  59.94,64.26 90 top
R32  64.26,64.26 90 top
R33  69.34,64.26 90 top
R34  74.12,64.26 90 top
R35  78.92,64.26 90 top
R43  73.48,18.97 180 top
R50  14.05,57.66 90 top
R51  23.11,57.66 90 top
R52  33.02,57.66 90 top
R53  42.34,57.66 90 top
R54  52.12,57.66 90 top
R55  61.49,57.66 90 top
R56  70.89,57.66 90 top
R57  80.21,57.63 90 top
RESET_BUTTON  77.47,39.37 90 top
SCHOTTKY  72.97,24.23 270 top
TC0  9.65,61.09 270 top
TC1  19.18,61.09 270 top
TC2  28.7,61.09 270 top
TC3  38.23,61.09 270 top
TC4  47.75,61.09 270 top
TC5  57.28,61.09 270 top
TC6  66.8,61.09 270 top
TC7  76.33,61.09 270 top
TP_BUTTON1  29.21,2.54 180 top
TP_BUTTON2  34.29,2.54 180 top
TP_GND  82.55,15.24 0 top
TP_RESET  83.31,39.62 90 top
TP_VBAT  82.55,17.78 0 top
U1  33.02,31.75 90 top
U$2  74.42,14.07 270 top
U$5  53.59,16 180 top
U$6  3.81,6.35 0 top
U$7  67.21,26.11 180 top
U$15  3.81,52.07 0 top
U$16  85.09,53.09 0 top
U$18  74.88,30.53 270 bottom
U$23  85.09,6.35 0 top
U$24  3.81,69.85 0 top
U$25  85.09,69.85 0 top
VCC  67.06,30.23 0 top
VIN_KK  81.79,24.38 270 top

### Tracks (layer width: path | path; a pad name or v marks a point on that pad's centre or on a via)
32KHZ
  Top 0.254: R1.1 21.75,20.72 DS3231M.1 23.5,17.65 24.13,17.02 34.31,17.02 34.75,17.45 34.75,18.29 34.59,18.44 34.59,25.6 34.54,25.65 35.05,26.16 35.05,27.43 U1.7
AGND  (via drill 0.33)
  Top 0.178: 5.2,59.57 v5.18,59.69 | 13.7,59.96 v13.72,59.84 | C4.1 23.25,59.91 v23.24,59.84 | C5.2 24.73,59.9 v24.74,59.84 | 42.23,59.93 v42.22,59.84 | 43.8,59.68 v43.79,59.84 | 51.75,59.68 v51.77,59.82 | C12.1 61.33,59.73 v61.32,59.84 | C13.2 62.88,59.7 v62.87,59.84 | 70.75,59.68 v70.74,59.84 | 72.3,59.81 v72.29,59.84 | 80.48,59.8 v80.47,59.79
  Top 0.254: U1.21 32.62,38.6 C39.2 31.77,38.66 28.83,41.6 28.83,45.72 29.72,46.61 v30.35,46.61 | C1.2 5.2,59.57 | C2.1 13.7,59.96 | C3.2 15.33,59.93 v15.34,59.82 | MAX1.AGND 21.85,55.62 v22.23,55.24 | MAX2.AGND 31.5,55.62 v31.75,55.37 | C6.1 32.88,59.96 v32.89,59.84 | C7.2 34.35,60.03 v34.37,59.84 | C8.1 42.23,59.93 | MAX3.AGND 40.8,55.6 v41.45,55.09 | C9.2 43.8,59.68 | MAX4.AGND 50.5,55.62 v50.98,55.24 | C10.1 51.75,59.68 | C11.2 53.28,59.68 v53.26,59.79 | C14.1 70.75,59.68 | C15.2 72.3,59.81 | C16.1 80.48,59.8 | MAX7.AGND 78.87,55.62 v79.48,55.12 | MAX0.AGND 12.78,55.62 v13.34,55.17 | MAX6.AGND 69.57,55.62 v70.05,55.14 | MAX5.AGND 59.92,55.62 v60.33,55.22
  Bottom 0.178: v13.34,55.17 13.21,54.86 | v5.18,59.69 5.59,59.44 | v13.72,59.84 15.11,59.59 v15.34,59.82 | v22.23,55.24 21.95,55.24 22.05,55.14 | v23.24,59.84 23.06,59.89 23.01,59.84 | v31.75,55.37 32,55.37 | v24.74,59.84 25.02,59.79 25.17,59.64 | v32.89,59.84 33.25,59.84 | v34.37,59.84 34.9,59.77 34.98,59.69 | v42.22,59.84 42.14,59.66 | v41.45,55.09 41.73,54.89 41.76,54.91 | v43.79,59.84 44.04,59.66 44.07,59.64 | v50.98,55.24 51.41,54.94 | v51.77,59.82 51.54,59.66 | v53.26,59.79 53.26,59.94 | v61.32,59.84 61.32,59.87 | v60.33,55.22 60.53,55.22 60.81,54.89 | v62.87,59.84 62.84,59.49 | v70.74,59.84 70.99,59.51 70.97,59.49 | v70.05,55.14 70.46,55.07 | v72.29,59.84 72.49,59.77 72.57,59.69 | v80.47,59.79 80.29,59.79 80.21,59.72 | v79.48,55.12 79.93,54.81 79.96,54.84
  Bottom 0.254: 23.11,52.7 22.73,52.45 22.61,52.58 | 13.59,52.45 13.46,52.58 | 41.91,52.7 41.78,52.45 41.4,52.58 | 60.83,52.58 60.45,52.58 | 31.5,52.45 AGND-GND-CON.2 30.73,51.94 30.28,51.49 30.28,49.4 30.61,49.07 30.61,46.89 30.35,46.63 v30.35,46.61
  pour Bottom: 0,52.45 88.9,52.45 88.9,82.55 0,82.55
AVCC
  Top 0.178: 37.1,38.66 INDUCTOR.P$1
  Top 0.254: U1.18 35.05,36.08 35.05,36.83 35.19,36.97 C39.1 37.1,38.66
BIAS0
  Top 0.254: MAX0.BIAS 11.66,56.14 12.19,56.67 14.04,56.67 R50.1 14.01,56.39
BIAS1
  Top 0.178: MAX1.BIAS 20.48,56.11 | R51.1
  Top 0.254: 20.48,56.11 21.03,56.67 R51.1
BIAS2
  Top 0.178: MAX2.BIAS 29.93,56.06 | 32.98,56.52 R52.1
  Top 0.254: 29.93,56.06 30.38,56.52 32.98,56.52
BIAS3
  Top 0.178: MAX3.BIAS 39.73,55.99 | 42.33,56.39 R53.1
  Top 0.254: 39.73,55.99 39.73,56.09 40.31,56.67 R53.1
BIAS4
  Top 0.178: MAX4.BIAS 49.26,56.09 | 52.06,56.44 R54.1
  Top 0.254: 49.26,56.09 49.61,56.44 52.06,56.44
BIAS5
  Top 0.178: MAX5.BIAS 58.68,56.11 | 61.46,56.39 R55.1
  Top 0.254: 58.68,56.11 58.68,56.27 59.08,56.67 R55.1
BIAS6
  Top 0.178: MAX6.BIAS 68.2,56.09 | 71.52,56.39 R56.1
  Top 0.254: 68.2,56.09 68.2,56.27 68.61,56.67 R56.1
BIAS7
  Top 0.178: MAX7.BIAS 77.81,56.04 | 80.74,56.39 R57.1
  Top 0.254: 77.81,56.04 77.81,56.29 78.16,56.64 80.2,56.64 R57.1
BUTTON1  (via drill 0.33)
  Top 0.254: v28.7,27.81 28.7,28.93 U1.32 | v25.2,15.52 25.2,14.15 BUTTON1.P$1
  Top 0.406: BUTTON1.P$1 25.18,11.14 28.19,8.13 28.19,4.83 TP_BUTTON1.1
  Bottom 0.254: v28.7,27.81 28.19,27.3 28.19,22.99 26.29,21.08 26.29,16.61 v25.2,15.52
BUTTON2  (via drill 0.33)
  Top 0.254: U1.1 30.22,26.17 30.48,25.91 v30.48,22.61 | v33.02,15.75 33.02,14.17 BUTTON2.P$1
  Top 0.406: BUTTON2.P$1 33.06,9.62 35.56,7.11 TP_BUTTON2.1
  Bottom 0.254: v33.02,15.75 31.24,15.75 29.72,17.27 29.72,21.34 30.48,22.1 v30.48,22.61
CS_MAX0
  Top 0.254: MAX0.!CS 9.06,47.18 | 9.06,47.18 R10.1 | 9.06,47.18 9.97,47.18 21.59,35.56 29.74,35.56 U1.24
CS_MAX1
  Top 0.178: MAX1.!CS 17.88,48.56 18.54,47.9
  Top 0.254: 18.54,47.5 18.54,47.9 R11.1 18.16,47.48 18.16,46.56 18.87,45.85 24.89,45.85 27.18,43.56 27.18,41.15 30.99,37.34 30.99,36.08 U1.23
CS_MAX2  (via drill 0.33)
  Top 0.178: MAX2.!CS 27.33,49.08 28.04,48.36 R12.1
  Top 0.254: R12.1 28.07,47.51 28.07,41.4 v31.75,37.72 | v35.43,30.61 37.26,30.61 U1.11
  Bottom 0.254: v31.75,37.72 31.75,34.29 v35.43,30.61
CS_MAX3
  Top 0.178: MAX3.!CS 37.13,47.82 R13.1 37.85,47.5 38.35,46.99
  Top 0.254: 37.59,47.64 R13.1 | U1.10 37.34,29.72 39.12,29.72 41.53,31.5 41.53,45.21 39.75,46.99 38.35,46.99
CS_MAX4  (via drill 0.33)
  Top 0.178: MAX4.!CS 46.66,47.69 R14.1 | v42.82,39.5 42.82,39.62 | 42.55,46.79 v42.77,47.02
  Top 0.254: 47.12,47.51 R14.1 47.23,47.12 48.11,47.12 v48.41,46.74 | U1.9 37.31,28.09 v37.34,28.07 | 42.82,39.62 42.55,39.9 42.55,46.79
  Bottom 0.254: v42.82,39.5 41.53,39.5 37.59,35.56 37.59,28.32 v37.34,28.07 | v42.77,47.02 48.16,47.02 v48.41,46.74
CS_MAX5  (via drill 0.33)
  Top 0.178: MAX5.!CS 56.08,48.33 56.64,47.77
  Top 0.254: 56.64,47.77 R15.1 56.24,45.72 v56.13,45.47 | U1.2 31.02,28.1 v35.81,32.89
  Bottom 0.254: v35.81,32.89 35.81,33.15 36.58,33.91 36.58,35.31 41.53,40.26 52.58,40.26 53.09,39.75 53.98,40.64 53.98,44.58 v56.13,45.47
CS_MAX6  (via drill 0.33)
  Top 0.178: MAX6.!CS 65.6,47.79 R16.1
  Top 0.254: 66.17,47.51 R16.1 66.02,44.18 60.71,38.86 53.72,38.86 v48.64,33.78 | v39.24,32.13 37.33,32.13 U1.13
  Bottom 0.254: v48.64,33.78 40.89,33.78 v39.24,32.13
CS_MAX7  (via drill 0.33)
  Top 0.178: MAX7.!CS 75.2,47.72 R17.1
  Top 0.254: 75.69,47.77 R17.1 70.6,41.66 64.26,41.66 53,30.39 v53,28 | U1.12 37.87,31.35 v38.61,30.61
  Bottom 0.254: v38.61,30.61 41.53,27.69 48.77,27.69 49.53,26.92 51.92,26.92 v53,28
CS_SD  (via drill 0.33)
  Top 0.254: U1.14 38.79,32.95 v39.24,33.4 | v46.74,28.57 46.74,23.37 v45.72,22.35 | v45.72,19.05 45.72,16.92 U$5.CS2
  Bottom 0.254: v39.24,33.4 38.99,33.4 38.61,33.02 38.61,31.62 41.4,28.57 v46.74,28.57 | v45.72,22.35 v45.72,19.05
DTR
  Top 0.254: C29.1 21.47,13.07 22.1,12.45 JP1.6
GND  (via drill 0.33)
  Top 0.178: C40.1 14.33,51.41 v14.73,50.93 | MAX0.DGND 12.7,49.79 v13.03,49.51 | MAX1.DGND 21.59,49.79 v21.84,49.53 | C41.1 v23.34,50.77 | C42.1 32.99,51.31 v33.27,50.85 | C43.1 42.57,50.9 v42.55,50.83 | C44.1 v52.02,50.72 | MAX4.DGND 50.26,49.76 v50.65,49.38 | C45.1 v61.49,50.72 | C46.1 70.79,50.62 v70.92,50.65 | C47.1 v80.44,50.7
  Top 0.254: LED1.C LED2.C 12.79,16.29 14.1,14.99 14.1,13.46 13.21,12.57 12.06,12.57 11.94,12.45 JP1.2 | DS3231M.5 28.26,25.16 C28.2 v29.46,26.16 | v79.63,33.4 79.63,35.3 RESET_BUTTON.P$1 | U1.3 31.82,26.36 v31.62,26.16 | U1.5 33.42,26.27 v33.53,26.16 | BUTTON1.S$1 29.68,15.71 v29.67,15.72 | BUTTON2.S$1 37.56,15.71 v37.57,15.72 38.78,16.93 U$5.MNT2 | U$5.MNT4 39.47,2.08 v39.42,2.13 | U$5.MNT3 55.68,2.08 55.88,2.29 55.88,4.06 U$18.GND | CR1220_BATTERY.GND 10.9,31.22 v10.92,31.24 | U$5.GND6 50.19,18.7 v50.29,18.8 | U$5.MNT1 53.79,18.74 v53.85,18.8 | 69.32,24.61 v69.34,24.64 | 77.61,22.47 C20.2 77.61,23.25 | 78.99,21.08 78.99,20.05 LTC4411.3 79.11,20.07 79.76,20.07 80.01,19.81 80.01,19.3 79.76,19.05 LTC4411.2 | C21.2 48.51,24.13 v49.28,24.89 50.46,23.71 C22.P$2_C | MAX6.DGND 69.36,49.79 v69.75,49.4 | MAX7.DGND 78.84,49.79 v79.2,49.43 | MAX5.DGND 59.79,49.79 v60.07,49.51 | MAX3.DGND 40.87,49.79 v41.17,49.48 | MAX2.DGND 30.96,49.79 v31.34,49.4
  Top 0.406: C23.- 64.77,24.23 v64.44,24.56 | C24.- 69.32,24.61 | 77.61,22.47 78.99,21.08 | 77.61,23.25 80.01,25.65 VIN_KK.1 | U$7.1 69.06,27.15 v69.34,27.43
  Bottom 0.178: v14.73,50.93 14.86,50.95 14.88,50.93 | v13.03,49.51 12.95,49.78 | v21.84,49.53 22.1,49.53 | v23.34,50.77 23.42,50.8 23.44,50.77 | v33.27,50.85 33.17,50.55 | v41.17,49.48 41.38,49.55 41.4,49.53 | v42.55,50.83 42.6,50.72 42.62,50.75 | v52.02,50.72 51.69,50.77 51.71,50.8 | v50.65,49.38 50.8,49.38 50.83,49.35 | v60.07,49.51 60.17,49.55 60.2,49.53 | v61.49,50.72 61.16,50.52 61.19,50.49 | v69.75,49.4 70,49.4 70.03,49.43 | v70.92,50.65 70.76,50.93 | v80.44,50.7 80.59,50.67 80.57,50.65 | v79.2,49.43 79.35,49.43 79.4,49.48
  Bottom 0.254: JP1.1 JP1.2 | 69.85,30.48 69.09,31.24 | 77.47,31.24 v79.63,33.4 | 40.77,26.54 39.5,26.54 39.37,26.67 | v31.62,26.16 31.62,25.53 31.75,25.4 | v33.53,26.16 33.78,26.16 34.29,26.67 | v29.46,26.16 29.46,26.42 29.21,26.67 | 41.53,9.27 41.91,8.89 | 55.63,28.96 55.88,29.21 | 56.64,11.56 56.64,12.19 57.15,12.7 | 30.99,46.35 31.5,46.86 v31.34,49.4 AGND-GND-CON.1 | OLED_0.GND | v29.67,15.72 29.67,16.1 29.64,16.13 | v37.57,15.72 37.57,15.98 37.59,16 | v50.29,18.8 50.29,19.05 | v53.85,18.8 54.1,18.8 | v64.44,24.56 64.06,24.56 64.03,24.54 | v69.34,24.64 69.34,24.38 | v69.34,27.43 69.34,27.69 | v49.28,24.89 49.28,25.4
  Bottom 0.406: 18.67,46.35 19.05,46.35 OLED_0.GND
  pour Bottom (isolate 0.254): 0,0 88.9,0 88.9,51.56 0,51.56
LED_GRN
  Top 0.254: U1.26 26.7,33.75 26.42,34.04 23.24,34.04 21.72,32.51 21.72,28.25 19.02,25.55 19.02,22.86 17.25,21.08 15.32,21.08 10.35,16.11 R19.1
LED_RED  (via drill 0.33)
  Top 0.254: U1.25 22.87,34.55 22.87,34.47 21.31,32.92 21.31,28.6 18.29,25.58 18.29,22.99 17.22,21.92 v16.89,21.89 | v16.89,20.32 16.89,19.54 R18.1
  Bottom 0.254: v16.89,21.89 v16.89,20.32
MISO  (via drill 0.33)
  Top 0.178: MAX2.SDO 28.63,49.05 29.34,48.34 v29.34,47.62 | MAX3.SDO 38.43,48.56 v38.76,47.78 40.13,47.78 | MAX4.SDO 47.95,48.56 v48.72,47.78 | MAX6.SDO 66.9,48.18 v67.44,47.6
  Top 0.254: U1.16 37.73,34.55 v39.37,36.07 | 40.13,47.78 42.06,45.82 42.06,38.81 42.29,38.58 v42.29,37.59 | v67.56,42.67 67.56,47.47 v67.44,47.6 | v50.4,33.8 50.4,29.1 52.3,27.2 52.3,19.8 51.3,18.8 U$5.MISO7 | MAX0.SDO 10.36,48.16 v10.9,47.62 | v19.41,47.62 19.41,47.9 19.18,48.13 MAX1.SDO | v29.34,47.62 32.51,47.62 v32.89,47.88 | MAX5.SDO 57.38,47.78 v57.45,47.7 | MAX7.SDO 76.5,48.08 v77.04,47.55
  Bottom 0.178: v48.72,47.78 52.05,47.78 52.22,47.6 57.35,47.6 v57.45,47.7
  Bottom 0.254: v10.9,47.62 v19.41,47.62 v29.34,47.62 | v48.72,47.78 v38.76,47.78 38.76,47.88 v32.89,47.88 | v57.45,47.7 v67.44,47.6 v77.04,47.55 | v42.29,37.59 42.29,37.08 | 42.29,37.08 42.29,36.83 43.05,34.54 49.66,34.54 v50.4,33.8 | v39.37,36.07 41.27,36.07 42.29,37.08 | J1.1 66.42,41.53 v67.56,42.67
MOSI  (via drill 0.33)
  Top 0.178: v29.95,48.54 29.79,48.56 29.29,49.07 29.29,49.78 MAX2.SDI | v19.81,48.77 19.81,49.77 MAX1.SDI | v39.45,48.72 39.4,48.72 39.09,49.02 39.09,49.75 MAX3.SDI | v48.97,48.72 48.74,48.72 48.59,48.87 48.59,49.75 MAX4.SDI | 42.19,34.9 v42.16,34.92 | v58.27,48.59 58.27,48.62 58.04,48.84 58.04,49.73 MAX5.SDI | v67.84,48.59 67.84,48.67 67.56,48.95 67.56,49.7 MAX6.SDI | v77.42,48.64 77.42,48.72 77.17,48.97 77.17,49.73 MAX7.SDI
  Top 0.254: U1.15 38.32,33.75 v39.5,34.92 | v42.16,34.92 42.16,24.38 46.99,19.56 46.99,16.94 U$5.MOSI3 | v19.81,48.77 24.13,48.77 v24.43,48.46 | 29.79,48.56 v32.05,48.56 | v39.45,48.72 43.2,48.72 v43.46,48.46 43.46,44.63 43.08,44.25 43.08,40.34 43.69,39.88 43.69,35.71 42.88,34.9 42.19,34.9 | v48.97,48.72 52.35,48.72 v52.65,48.41 | 58.27,48.62 v60.53,48.62 | 67.84,48.67 71.55,48.67 v71.93,48.28 71.93,47.55 71.12,46.74 v71.12,43.94 | v71.91,38.35 71.91,38.9 R3.1 | MAX0.SDI 11.01,48.68 11.43,48.26 v14.73,48.26
  Bottom 0.178: 29.72,48.46 v29.95,48.54 | 34.72,48.56 34.77,48.51 | 39.4,48.77 v39.45,48.72 | 58.09,48.41 v58.27,48.59
  Bottom 0.254: v39.5,34.92 v42.16,34.92 | v14.73,48.26 18.29,48.26 18.8,48.77 v19.81,48.77 | v24.43,48.46 29.72,48.46 | v32.05,48.56 34.72,48.56 | 34.77,48.51 38.25,48.51 38.51,48.77 39.4,48.77 | v43.46,48.46 47.68,48.46 47.93,48.72 v48.97,48.72 | v52.65,48.41 58.09,48.41 | v60.53,48.62 61.39,48.62 61.85,48.16 66.65,48.16 66.93,48.44 67.69,48.44 v67.84,48.59 | v71.93,48.28 77.06,48.28 v77.42,48.64 | v71.12,43.94 70.66,43.94 67.69,40.97 67.69,38.61 J1.4 71.14,37.59 v71.91,38.35
N$1
  Top 0.254: R43.1 75.42,18.97
  Top 0.406: 75.42,18.97 LTC4411.4
N$2
  Top 0.254: 74.42,16.92 73.51,17.83 73.51,21.65 SCHOTTKY.A
  Top 0.406: U$2.P$1 74.42,16.92
N$5
  Top 0.254: LED1.A 15.71,14.19 17.14,15.62 17.14,17.03 R18.2
N$7
  Top 0.254: U$5.RES8 52.43,16.87 52.43,18.69 53.41,19.68 54.38,19.68 55.5,20.8 55.5,22.34 R8.1
N$8  (via drill 0.33)
  Top 0.254: v44.7,23.37 45.72,24.38 45.72,26.41 R9.1 | v44.7,19.05 44.7,16.85 U$5.NC1
  Bottom 0.254: v44.7,23.37 v44.7,19.05
N$9  (1 unrouted)
  Top 0.254: U1.4 32.62,25.27 C38.1
N$10
  Top 0.254: R19.2 12.62,14.11 LED2.A
N$13
  Top 0.178: R22.2 17.02,65.28
  Top 0.61: 17.02,65.28 TC1.P$2
N$14
  Top 0.178: 21.52,65.79 R23.2 | R51.2 23.53,58.66 23.98,59.05
  Top 0.254: 23.98,59.05 23.98,64.45 R23.2
  Top 0.61: TC1.P$1 19.18,63.88 21.08,65.79 21.52,65.79
N$17
  Top 0.254: R24.2 26.16,66.17
  Top 0.61: TC2.P$2 27.43,67.44 26.16,66.17
N$18
  Top 0.178: 30.8,65.47 31.46,65.47 R25.2 31.89,65.51 | R52.2 33.02,58.57 33.63,59.18
  Top 0.254: 33.63,59.18 33.63,64.8 32.92,65.51 31.89,65.51
  Top 0.61: 30.8,65.47 28.7,63.37 TC2.P$1
N$21
  Top 0.254: R26.2 35.94,66.23
  Top 0.61: TC3.P$2 37.33,67.44 35.94,66.23
N$22
  Top 0.178: 41.26,65.28 R27.2 | 41.14,65.28 R27.2 | R53.2 42.6,58.38 43.03,59.05 | 41.44,65.3 R27.2
  Top 0.254: 39.88,65.28 41.14,65.28 | 43.03,59.05 43.03,64.54 42.47,65.3 41.44,65.3
  Top 0.61: TC3.P$1 38.23,63.26 38.23,63.63 39.88,65.28
N$25
  Top 0.178: R28.2 45.44,66.18
  Top 0.61: TC4.P$2 46.85,67.44 45.44,66.18
N$26
  Top 0.178: R54.2 52.12,59 | 50.86,65.81 R29.2
  Top 0.254: 52.12,59 52.48,59.36 52.48,65.23 51.89,65.81 50.86,65.81 | 49.53,65.41 50.71,65.41 R29.2
  Top 0.61: TC4.P$1 47.75,63.63 49.53,65.41
N$29
  Top 0.254: R30.2 54.91,66.15
  Top 0.61: TC5.P$2 56.38,67.44 54.91,66.15
N$30
  Top 0.178: 59.93,65.53 R31.2 59.95,65.51 | R55.2 61.49,58.6 62.05,59.16
  Top 0.254: 58.85,65.53 59.93,65.53 | 62.05,59.16 62.05,64.72 61.27,65.51 59.95,65.51
  Top 0.61: TC5.P$1 57.28,63.63 58.85,65.53
N$33
  Top 0.178: R32.2 64.31,66.18
  Top 0.61: TC6.P$2 65.9,67.44 64.31,66.18
N$34
  Top 0.178: 68.28,65.21 R33.2 69.36,65.53 | R56.2 71.53,58.45 71.5,59.08
  Top 0.254: 71.5,59.08 71.5,64.47 70.76,65.53 69.36,65.53
  Top 0.61: TC6.P$1 66.8,63.37 68.28,65.21
N$37
  Top 0.254: R34.2 74.12,66.13
  Top 0.61: TC7.P$2 75.43,67.44 74.12,66.13
N$38
  Top 0.178: 76.33,63.5 76.33,63.63 | 78.91,65.28 R35.2 78.93,65.28 | R57.2 80.8,58.8
  Top 0.254: 77.85,65.23 78.91,65.28 | 80.8,58.8 81.2,59.21 81.2,64.39 80.31,65.28 78.93,65.28
  Top 0.61: 76.33,63.5 TC7.P$1 | 76.33,63.63 77.85,65.23
RESET  (via drill 0.33)
  Top 0.254: v25.78,33.27 25.13,32.62 R2.1 25.12,30.96 19.56,25.4 19.56,22.48 18.67,21.59 18.67,16.51 18.41,16.26 C29.2 | U1.29 28.87,31.5 v30.48,31.5 33.02,31.5 v35.81,34.29 | v73.41,35.43 75.18,35.43 RESET_BUTTON.S$1 75.22,37.12 78.99,40.89 TP_RESET.2 | v53.09,40.77 v61.21,40.77
  Bottom 0.254: v25.78,33.27 28.7,33.27 v30.48,31.5 | v35.81,34.29 35.81,35.18 41.4,40.77 v53.09,40.77 | v61.21,40.77 63.37,40.77 63.75,40.39 63.75,37.72 J1.5 66.42,34.29 67.56,33.15 71.12,33.15 v73.41,35.43
SCK  (via drill 0.33)
  Top 0.178: 59.97,46.45 R4.1 | 18.54,49.8 MAX1.SCK | 18.52,51.05 18.54,51.03 | 27.96,50.6 27.96,49.8 MAX2.SCK 27.98,50.48 | 37.77,50.49 37.77,49.77 MAX3.SCK | 47.3,49.77 MAX4.SCK 47.3,50.66 | 54.97,50.8 55.09,50.93 | 56.74,50.7 56.74,49.75 MAX5.SCK 56.73,50.58 | 63.91,50.04 64.02,49.92 | 64.06,49.96 64.47,50.37 64.47,50.6 64.64,50.77 66.06,50.77 66.24,50.6 66.24,49.72 MAX6.SCK 66.25,50.56 66.47,50.77 69.52,50.77 70.28,50.01 71.6,50.01 71.63,50.04 73.81,50.04 74.02,50.24 74.02,50.6 74.27,50.85 75.67,50.85 75.87,50.65 75.87,49.75 MAX7.SCK
  Top 0.254: 33.6,49.91 33.53,49.91 32.08,49.91 31.09,50.9 28.4,50.9 27.98,50.48 | U1.17 38.33,36.04 40.89,38.61 | 33.6,49.91 33.6,46.74 33.98,45.97 39.75,45.97 41.02,44.96 41.02,38.73 40.89,38.61 | 64.06,49.96 64.02,49.92 62.74,48.64 61.77,48.64 59.94,46.8 R4.1 | v40.89,32 40.89,38.61 | 18.54,49.8 18.54,51.03 19.18,51.66 21.13,51.66 22.89,49.91 26.04,49.91 26.24,50.11 26.24,50.52 26.59,50.88 27.69,50.88 27.96,50.6 | 18.52,51.05 17.02,51.05 16.76,50.8 16.76,50.29 16.51,50.04 14.61,50.04 12.83,51.82 12.8,51.79 10.16,51.79 9.71,51.34 MAX0.SCK | 33.6,49.91 35.33,49.91 36.14,50.72 37.54,50.72 37.77,50.49 38.08,50.8 40.89,50.8 41.78,49.91 45.29,49.91 45.49,50.11 45.49,50.75 45.64,50.9 47.12,50.9 47.3,50.72 47.3,49.77 | 47.3,50.66 47.55,50.9 49.94,50.9 50.8,50.04 54.61,50.04 54.97,50.39 54.97,50.8 | 55.09,50.93 56.52,50.93 56.74,50.7 | 56.73,50.58 57.07,50.93 59.87,50.93 60.76,50.04 63.91,50.04 | U$5.SCK5 49.02,16.91 49.02,17.27 49.12,17.37 49.12,19.2 50.29,20.37 50.34,20.37 51.82,21.84 51.82,26.54 v50.55,27.81 | 59.97,46.45 59.97,45.64 60.27,45.34 62.48,45.34 v64.26,43.56
  Bottom 0.254: v64.26,43.56 64.26,39.5 J1.3 | v40.89,32 40.89,30.99 42.42,29.46 48.01,29.46 49.78,27.69 50.42,27.69 v50.55,27.81
SCL  (via drill 0.33)
  Top 0.254: R5.1 47.99,41.64 OLED_1.SCL | DS3231M.8 23.5,28.45 v25.15,30.1 | v27.3,30.99 27.3,31.5 27.94,32.13 28.71,32.13 U1.28 30.75,32.15 v31.24,32.64
  Bottom 0.254: v25.15,30.1 26.04,30.99 v27.3,30.99 | v31.24,32.64 31.24,37.08 26.92,41.4 23.36,41.4 OLED_0.SCL 23.75,45.21 48.51,45.21 OLED_1.SCL
SDA  (via drill 0.33)
  Top 0.254: R6.1 48.39,35.56 52.07,39.24 OLED_1.SDA 50.66,44.58 v47.75,44.58 | DS3231M.7 24.77,28.57 26.67,30.48 26.67,31.75 27.81,32.89 28.67,32.89 U1.27 30.28,32.95 v30.48,33.15 | v25.02,40.39 25.02,42.28 OLED_0.SDA
  Bottom 0.254: v30.48,33.15 30.48,36.96 27.05,40.39 v25.02,40.39 | OLED_0.SDA 24.13,44.06 24.64,44.58 v47.75,44.58
T+0
  Top 0.178: 6.99,60.92 C1.1 6.99,60.9 | C30.2 8.68,57.87
  Top 0.254: MAX0.T+ 10.36,56.23 C30.2
  Top 0.406: R20.1 6.53,62.31 6.99,61.85 6.99,60.92 | 8.68,57.87 6.99,59.56 6.99,60.9
T+0_TERM
  Top 0.178: R20.2 7.31,66.2
  Top 0.61: TC0.P$2 8.75,67.44 7.31,66.2
T+1
  Top 0.178: 17.13,62.39 R22.1
  Top 0.254: 18.54,57.01 C31.2 19.18,56.38 MAX1.T+
  Top 0.406: 17.13,62.39 C3.1 17.13,58.42 C31.2
T+2
  Top 0.254: 28.07,57.01 C32.2 28.63,56.45 MAX2.T+ | 26.53,62.92 R24.1
  Top 0.406: C32.2 26.53,58.55 C5.1 26.53,62.92
T+3
  Top 0.178: MAX3.T+ 38.43,56.17 | C33.2 37.33,57.92 | 36.07,61.02 C7.1 | 36.16,62.72 R26.1
  Top 0.254: 37.59,57.01 C33.2 38.43,56.17
  Top 0.406: 37.33,57.92 36.07,59.18 36.07,61.02 | C7.1 36.16,62.72
T+4
  Top 0.178: 45.72,60.62 C9.1 | 45.6,63.07 R28.1
  Top 0.254: MAX4.T+ 47.95,56.17 C34.2 46.85,58.05
  Top 0.406: 46.85,58.05 45.72,59.18 45.72,60.62 | C9.1 45.6,63.07
T+5
  Top 0.178: C35.2 56.38,57.41 | 55.12,60.77 C11.1 | 55.08,63.1 R30.1
  Top 0.254: 56.64,57.01 C35.2 57.38,56.27 MAX5.T+
  Top 0.406: 56.38,57.41 55.12,58.67 55.12,60.77 | C11.1 55.08,63.1
T+6
  Top 0.178: 64.65,62.87 R32.1 | 64.67,60.9 C13.1 | 66.17,57.01 66.17,56.95
  Top 0.254: 66.17,57.01 C36.2 65.9,58.02 | 66.17,56.95 66.9,56.21 MAX6.T+
  Top 0.406: C13.1 64.65,62.87 | 65.9,58.02 64.67,59.26 64.67,60.9
T+7
  Top 0.178: 74.17,60.84 C15.1 | 74.1,62.97 R34.1
  Top 0.254: 75.69,57.01 C37.2 | C37.2 75.43,58.18 | MAX7.T+ 76.5,56.2 C37.2
  Top 0.406: 75.43,58.18 74.17,59.44 74.17,60.84 | C15.1 74.1,62.97
T-0
  Top 0.178: R21.1 12.71,63.33 12.54,63.5 | 11.94,60.85 C2.2
  Top 0.254: C30.1 10.86,58.18 | 11.9,63.21 12.19,63.5 | 11.01,57.12 C30.1 | MAX0.T- 11.01,57.38 C30.1
  Top 0.406: 10.86,58.18 11.94,59.44 11.94,60.85 | C2.2 11.9,63.21 | 12.19,63.5 12.54,63.5
T-0_TERM
  Top 0.178: R50.2 14.13,58.4 14.55,58.83 | 13.29,65.53 R21.2
  Top 0.254: R21.2 11.76,65.24 | 14.55,58.83 14.55,65.2 14.22,65.53 13.29,65.53
  Top 0.61: TC0.P$1 9.65,63.26 11.76,65.24
T-1
  Top 0.178: 19.83,57.03 C31.1 | 21.34,60.84 C4.2 | 22.59,63.75 R23.1
  Top 0.254: 19.81,57.01 C31.1 20.08,58.18 | MAX1.T- 19.83,57.03 | 21.84,63.75 22.59,63.75
  Top 0.406: 20.08,58.18 21.34,59.44 21.34,60.84 | C4.2 21.45,63.36 21.84,63.75
T-2
  Top 0.178: 29.28,56.95 C32.1 | 30.99,61.02 C6.2
  Top 0.254: 29.34,57.01 C32.1 29.6,58.05 | MAX2.T- 29.28,56.95
  Top 0.406: R25.1 31.85,61.88 C6.2 | 29.6,58.05 30.99,59.44 30.99,61.02
T-3
  Top 0.178: 39.08,57.23 C33.1 39.24,57.28 | 40.78,62.92 R27.1
  Top 0.254: 38.86,57.01 C33.1 | MAX3.T- 39.08,57.23 | 40.43,62.56 R27.1 | 39.24,57.28 39.24,58.27 | 40.41,60.95 C8.2
  Top 0.406: C8.2 40.43,62.56 | 39.24,58.27 40.41,59.44 40.41,60.95
T-4
  Top 0.178: 48.6,57.23 C34.1 | 49.96,60.8 C10.2
  Top 0.254: 48.39,57.01 C34.1 48.65,57.97 | MAX4.T- 48.6,57.23 | 49.95,62.92 R29.1
  Top 0.406: 48.65,57.97 49.96,59.28 49.96,60.8 | C10.2 49.95,62.92
T-5
  Top 0.178: 58.03,57.13 C35.1 58.18,57.67 | 59.44,60.82 C12.2 | 59.53,63.1 R31.1
  Top 0.254: 57.91,57.01 C35.1 | MAX5.T- 58.03,57.13
  Top 0.406: 58.18,57.67 59.44,58.93 59.44,60.82 | C12.2 59.53,63.1
T-6
  Top 0.178: 67.7,57.62 C36.1 67.55,57.13
  Top 0.254: 67.44,57.01 C36.1 | MAX6.T- 67.55,57.13 | 67.7,57.62 67.7,58.18 | 68.96,60.95 C14.2 | 68.95,62.87 R33.1
  Top 0.406: 67.7,58.18 68.96,59.44 68.96,60.95 | C14.2 68.95,62.87
T-7
  Top 0.178: 78.92,61.17 C16.2 78.74,60.87 | 77.16,57.2 C37.1
  Top 0.254: 76.96,57.01 C37.1 77.23,57.92 | MAX7.T- 77.16,57.2
  Top 0.406: R35.1 78.92,61.17 | 77.23,57.92 78.74,59.44 78.74,60.87
TO_FTDI_RX  (via drill 0.33)
  Top 0.254: U1.31 27.97,29.75 27.56,29.34 v27.56,28.19
  Bottom 0.254: v27.56,28.19 27.56,23.24 v19.56,14.94 JP1.5
TO_FTDI_TX  (via drill 0.33)
  Top 0.254: v26.8,29.34 27.94,30.48 28.66,30.48 U1.30
  Bottom 0.254: v26.8,29.34 26.8,23.37 17.53,14.1 v17.02,13.97 JP1.4
VBAT  (via drill 0.33)
  Top 0.254: v22.48,23.75 22.48,23.11 23.24,22.35 25.02,22.35 26.04,23.37 DS3231M.6 | CR1220_BATTERY.P$2 3.81,35.26 3.81,26.92 7.14,23.6 CR1220_BATTERY.P$1 7.42,23.62 8.13,23.62 8.26,23.75 v17.4,23.75
  Bottom 0.254: v17.4,23.75 v22.48,23.75
VBATTERY  (via drill 0.33)
  Top 0.254: 79.05,17.07 v78.99,17.02 | 68.58,4.17 U$18.VBAT
  Top 0.406: VIN_KK.2 82.55,22.35 TP_VBAT.1 82.23,18.1 LTC4411.1 79.05,17.07 | v68.58,14.73 68.58,4.17
  Bottom 0.406: v78.99,17.02 70.87,17.02 v68.58,14.73
VCC  (via drill 0.33)
  Top 0.178: 14.36,53.59 C40.2 | 7.01,47.13 R10.2 | R4.2 63.13,46.48 R16.2 | v16.13,49.02 16.46,49.02 MAX1.DVDD | 23.07,53.59 C41.2 23.25,53.59 | 27.94,55.59 MAX2.AVDD | v25.53,49.1 26.01,49.1 MAX2.DVDD | 37.8,54.59 37.8,55.58 MAX3.AVDD | MAX3.DVDD 36.48,49.76 35.89,49.17 35.2,49.17 v35.18,49.15 | 47.24,54.36 47.24,55.54 MAX4.AVDD | 56.72,53.98 56.72,55.56 MAX5.AVDD | v54.23,49.15 54.94,49.15 MAX5.DVDD | 66.29,54.36 66.29,55.51 MAX6.AVDD 66.25,54.4 | 70.75,53.34 C46.2 | MAX6.DVDD 64.95,49.21 64.64,48.9 v64.01,48.9 | 75.84,54.36 75.84,55.56 MAX7.AVDD 75.86,54.3 | 80.58,53.37 C47.2 | MAX7.DVDD 74.56,49.38 74.19,49.02 v73.28,49.02
  Top 0.254: DS3231M.2 24.77,20.7 | 24.77,20.7 25.02,20.95 27.06,20.95 C28.1 29.46,22.61 30.48,21.59 31.75,21.59 32.51,22.35 C38.2 | 24.77,20.7 24.13,20.7 22.1,22.73 21.23,22.73 R1.2 | R1.2 21.21,26.04 v22.35,27.18 | v22.48,30.1 22.48,31.1 R2.2 23.62,32.24 v23.62,33.27 | R1.2 20.81,22.72 v19.43,21.34 | v72.21,46.71 72.91,46.99 R17.2 73.28,47.64 v73.28,49.02 | v32.92,46.91 32.92,45.77 33.17,45.44 39.65,45.44 40.49,44.6 40.49,39.12 39.95,38.58 INDUCTOR.P$2 | v34.29,46.94 R13.2 35.45,48.88 v35.18,49.15 | v16.13,49.02 16.13,47.51 R11.2 16.14,43.54 OLED_0.VCC 18.66,41.02 19.05,41.02 v23.11,36.96 | 25.78,47.77 R12.2 25.53,48.02 v25.53,49.1 | 35.43,53.21 35.43,50.93 v35.18,50.67 | 45.09,53.34 45.09,51.05 v44.7,50.67 | 54.48,53.21 54.48,50.93 v54.23,50.67 | v54.23,49.15 54.23,47.39 R15.2 | 64.01,53.09 64.01,50.93 v63.75,50.67 | v64.01,48.9 64.01,47.39 R16.2 | 73.66,53.21 73.66,51.05 v73.28,50.67 | J1.2 69.47,40.13 | v16.13,50.67 16.13,52.7 | 16.13,52.7 15.24,53.59 14.36,53.59 | MAX1.AVDD 18.53,53.86 | 18.53,53.86 18.8,53.59 23.07,53.59 | 16.13,52.7 17.37,52.7 18.53,53.86 | v25.43,50.55 25.43,53.37 | 25.43,53.37 25.4,53.59 23.25,53.59 | 25.43,53.37 26.92,53.34 27.94,54.36 | 27.94,54.36 27.94,55.59 | 27.94,54.36 28.74,53.55 C42.2 35.09,53.55 35.43,53.21 | 35.43,53.21 36.42,53.21 37.8,54.59 38.85,53.53 C43.2 44.9,53.53 45.09,53.34 | 45.09,53.34 46.23,53.34 47.24,54.36 48.17,53.43 C44.2 54.27,53.43 54.48,53.21 | 54.48,53.21 55.96,53.21 56.72,53.98 57.27,53.43 C45.2 63.67,53.43 64.01,53.09 | 64.01,53.09 65.02,53.09 66.29,54.36 | 66.25,54.4 67.31,53.34 70.75,53.34 | C46.2 73.5,53.38 73.66,53.21 | 73.66,53.21 74.7,53.21 75.84,54.36
  Top 0.254: 75.86,54.3 76.78,53.37 80.58,53.37 | 49.53,21.08 48.01,19.56 | 48.01,19.56 48.01,16.85 U$5.VDD4 | 71.8,18.29 R43.2 | 66.27,29.44 VCC.1 | 49.53,21.08 49.39,21.08 C21.1 47.5,22.98 47.5,26.25 R9.2 48,26.76 48,29 45.99,31.01 R6.2 R5.2 44.45,39.64 OLED_1.VCC 44.97,43.7 R14.2 44.83,47.51 v44.83,49.12 45.34,49.12 MAX4.DVDD | 49.53,21.08 49.62,21.08 C22.P$1_A | v73.41,43.31 72.75,42.65 R3.2 72.48,41.74 | R8.2 53.47,20.83 v53.5,20.8 | v47.9,20.3 47.9,19.66 48.01,19.56 | C40.2 14.31,53.62 10.36,53.62 9.71,54.27 MAX0.AVDD 9.73,55.51 9.73,54.25 8.41,52.94 MAX0.DVDD 7,48.38 R10.2
  Top 0.406: 69.47,40.13 70.61,38.99 70.61,33.78 VCC.1 62.99,26.16 62.99,17.02 63.75,16.26 67.28,16.26 C24.+ 71.8,18.29 | U$7.2 66.27,29.44 | 72.48,41.74 70.87,40.13 J1.2
  Bottom 0.254: v22.35,27.18 22.35,29.97 v22.48,30.1 | v19.43,21.34 19.43,17.65 14.48,12.7 JP1.3 | v73.41,43.31 73.41,45.85 v72.21,46.71 | v32.92,46.91 34.11,46.91 v34.29,46.94 | v35.18,49.15 v35.18,50.67 35.18,50.8 | v16.13,50.67 v16.13,49.02 | v25.43,50.55 25.4,49.23 v25.53,49.1 | v44.7,50.67 44.7,49.15 v44.83,49.12 | v54.23,50.67 v54.23,49.15 | v63.75,50.67 63.75,49.15 v64.01,48.9 | v73.28,50.67 v73.28,49.02 | v23.11,36.96 23.11,33.78 v23.62,33.27 | v53.5,20.8 48.4,20.8 v47.9,20.3
VRAW1
  Top 0.254: LTC4411.5 76.77,18.1 | C20.1 75.81,23.45
  Top 0.406: 76.77,18.1 77.47,18.8 77.47,21.2 C20.1 | PWR_DISCONNECT.1 71.24,26.28 SCHOTTKY.C 75.81,23.45 76.31,23.45 76.31,24.23 81.92,29.84 83.11,29.84 PWR_JUMPER.1
VRAW2
  Top 0.254: U$7.3 67.74,25.07
  Top 0.406: C23.+ 67.21,20.75 U$7.3 | 67.74,25.07 68.1,25.07 68.71,25.68 69.62,25.68 PWR_DISCONNECT.2 69.98,26.8 70.48,27.3 70.48,32.21 72.44,34.16 77.65,34.16 79.43,32.38 83.11,32.38 PWR_JUMPER.2

### Text on the board
tPlace: RESET | OLED 0 | OLED 1 | GND | CUT TO USE / PWR JUMPER | VBAT | GND | GND / BATT | + / BATT | GND | B1 | GND | B2
bPlace: RESET | GND | VBAT | GND / BATT | + / BATT
tNames: MAX31856 | MAX31856 | MAX31856 | MAX31856 | MAX31856 | MAX31856 | MAX31856 | MAX31856 | RESET | ISP | MISO | VCC | SCK | MOSI | RST | GND | CR1220 | Thermocouple datalogger / Rev B / Luke Miller 2017 | GND | VREG | + | + | + | DTR | + | + | VCC | DTR | BLK | 3V3 ONLY | GREEN | DTR
bNames: TC0 | TC7 | Thermocouple datalogger / Rev B / Luke Miller 2017 | GND | + | VCC | VCC | DTR | GND